# Altium schematic sheet Sheet1.SchDoc
size A
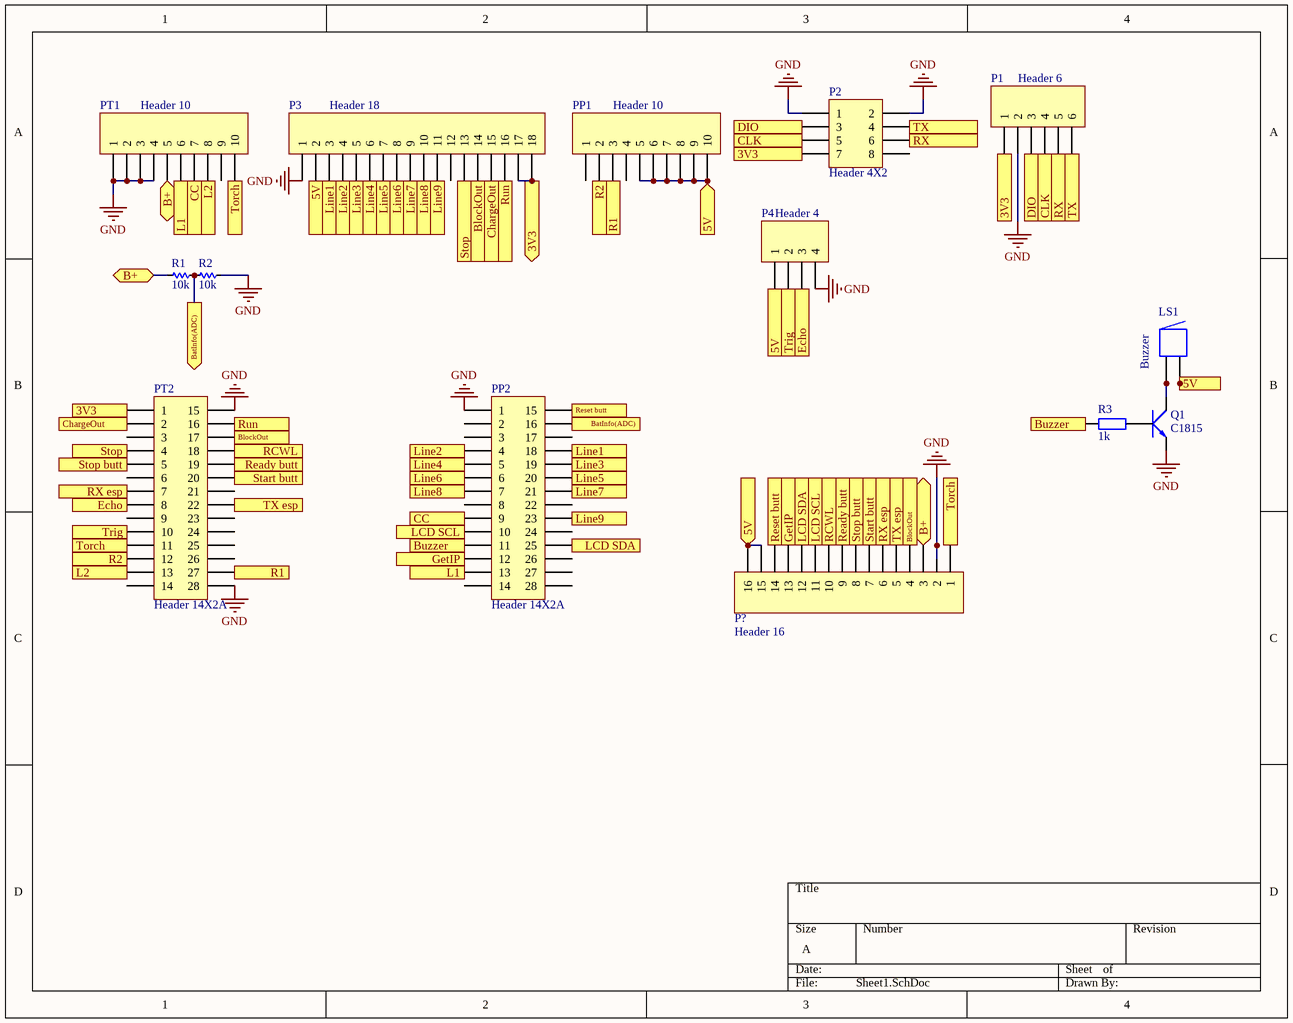
[diagram p0: Sheet1.SchDoc]

## Parts
LS1  Buzzer  [ABSM-1574]
P1  Header 6  [HDR1X6]
P2  Header 4X2  [HDR2X4]
P3  Header 18  [HDR1X18]
P4  Header 4  [HDR1X4]
P?  Header 16  [HDR1X16]
PP1  Header 10  [HDR1X10]
PP2  Header 14X2A  [HDR2X14_CEN]
PT1  Header 10  [HDR1X10]
PT2  Header 14X2A  [HDR2X14_CEN]
Q1  C1815  [QTO-92]
R1  10k  [RES-1/4W]
R2  10k  [RES-1/4W]
R3  1k  [R1/4W]

## Ports
3V3, 3V3 (out), 5V, 5V (in), B+ (bidir), BatInfo(ADC) (out), BlockOut (out), Buzzer, CC (in), ChargeOut (out), CLK, DIO, Echo, GetIP, L1, L2, LCD SCL, LCD SDA, Line1 (out), Line2 (out), Line3 (out), Line4 (out), Line5 (out), Line6 (out), Line7 (out), Line8 (out), Line9 (out), R1, R2, RCWL, Ready butt, Reset butt, Run (in), RX, RX esp, Start butt, Stop (in), Stop butt, Torch (in), Torch (out), Trig, TX, TX esp

## Nets
GND: P1.2 P2.1 P2.2 P3.1 P4.4 P?.2 PP2.1 PT1.1 PT1.2 PT1.3 PT1.4 PT2.15 PT2.28 Q1.1(E) R2.2
3V3: P1.1 P2.7 P3.17 P3.18 PT2.1 ; port 3V3
5V: LS1.2 LS1.2A P3.2 P4.1 P?.15 P?.16 PP1.5 PP1.6 PP1.7 PP1.8 PP1.9 PP1.10 ; port 5V
B+: P?.3 PT1.5 R1.2 ; port B+
BatInfo(ADC): PP2.16 R1.1 R2.1 ; port BatInfo(ADC)
BlockOut: P3.14 P?.4 PT2.17 ; port BlockOut
Buzzer: PP2.11 R3.1 ; port Buzzer
CC: PP2.9 PT1.7 ; port CC
ChargeOut: P3.15 PT2.2 ; port ChargeOut
CLK: P1.4 P2.5 ; port CLK
DIO: P1.3 P2.3 ; port DIO
Echo: P4.3 PT2.8 ; port Echo
GetIP: P?.13 PP2.12 ; port GetIP
L1: PP2.13 PT1.6 ; port L1
L2: PT1.8 PT2.13 ; port L2
LCD SCL: P?.11 PP2.10 ; port LCD SCL
LCD SDA: P?.12 PP2.25 ; port LCD SDA
Line1: P3.3 PP2.18 ; port Line1
Line2: P3.4 PP2.4 ; port Line2
Line3: P3.5 PP2.19 ; port Line3
Line4: P3.6 PP2.5 ; port Line4
Line5: P3.7 PP2.20 ; port Line5
Line6: P3.8 PP2.6 ; port Line6
Line7: P3.9 PP2.21 ; port Line7
Line8: P3.10 PP2.7 ; port Line8
Line9: P3.11 PP2.23 ; port Line9
R1: PP1.3 PT2.27 ; port R1
R2: PP1.2 PT2.12 ; port R2
RCWL: P?.10 PT2.18 ; port RCWL
Ready butt: P?.9 PT2.19 ; port Ready butt
Reset butt: P?.14 PP2.15 ; port Reset butt
Run: P3.16 PT2.16 ; port Run
RX: P1.5 P2.6 ; port RX
RX esp: P?.6 PT2.7 ; port RX esp
Start butt: P?.7 PT2.20 ; port Start butt
Stop: P3.13 PT2.4 ; port Stop
Stop butt: P?.8 PT2.5 ; port Stop butt
Torch: P?.1 PT1.10 PT2.11 ; port Torch
Trig: P4.2 PT2.10 ; port Trig
TX: P1.6 P2.4 ; port TX
TX esp: P?.5 PT2.22 ; port TX esp
NetLS1_1: LS1.1 LS1.1A Q1.2(C)
NetQ1_3: Q1.3(B) R3.2

Not connected (* = marked no-connect by the designer): P2 8; P3 12; PP1 1 4; PP2 2 3 8 14 17 22 24 26 27 28; PT1 9; PT2 3 6 9 14 21 23 24 25 26

## Library data of the parts
LS1 = Buzzer: Magnetic Transducer Buzzer; Published: 24-Mar-1999; LatestRevisionDate: 17-Dec-2003; LatestRevisionNote: Schematic revised, PCB Footprint replaced.; DatasheetVersion: 17-Dec-2003; PackageReference: ABSM-1574; Publisher: Altium Limited; PackageDescription: Magnetic Transducer Buzzer; ComponentLink1Description: Manufacturer Link; ComponentLink1URL: http://www.megastar.com/linecard/buzzmode/index.php
P1 = Header 6: Header, 6-Pin; LatestRevisionDate: 17-Jul-2002; LatestRevisionNote: Re-released for DXP Platform.; Publisher: Altium Limited
P2 = Header 4X2: Header, 4-Pin, Dual row; LatestRevisionDate: 17-Jul-2002; LatestRevisionNote: Re-released for DXP Platform.; Publisher: Altium Limited
P3 = Header 18: Header, 18-Pin; LatestRevisionDate: 17-Jul-2002; LatestRevisionNote: Re-released for DXP Platform.; Publisher: Altium Limited
P4 = Header 4: Header, 4-Pin; LatestRevisionDate: 17-Jul-2002; LatestRevisionNote: Re-released for DXP Platform.; Publisher: Altium Limited
P? = Header 16: Header, 16-Pin; LatestRevisionDate: 17-Jul-2002; LatestRevisionNote: Re-released for DXP Platform.; Publisher: Altium Limited
PP1 PT1 = Header 10: Header, 10-Pin; LatestRevisionDate: 17-Jul-2002; LatestRevisionNote: Re-released for DXP Platform.; Publisher: Altium Limited
PP2 PT2 = Header 14X2A: Header, 14-Pin, Dual row; LatestRevisionDate: 17-Jul-2002; LatestRevisionNote: Re-released for DXP Platform.; Publisher: Altium Limited
Q1 = C1815: NPN 600mW, ECB; Value: C1815
R1 R2 = Res: Manufacturer: Generic Components; Class: Passive; SubClass: R; Published: 08/06/2000; Publisher: Altium Hobart Technology Centre
R3 = R1/4W: Resistor 1/4W; Value: R1/4W - 1K